# Altium schematic sheet Camera_MCU.SchDoc: Camera Board MCU
size A4; DrawnBy: byu17; Organization: ENEL429 Group 9; Address1: ECE Department; Address2: University of Canterbury; Address3: Christchurch 8041; Address4: New Zealand; Revision: 1
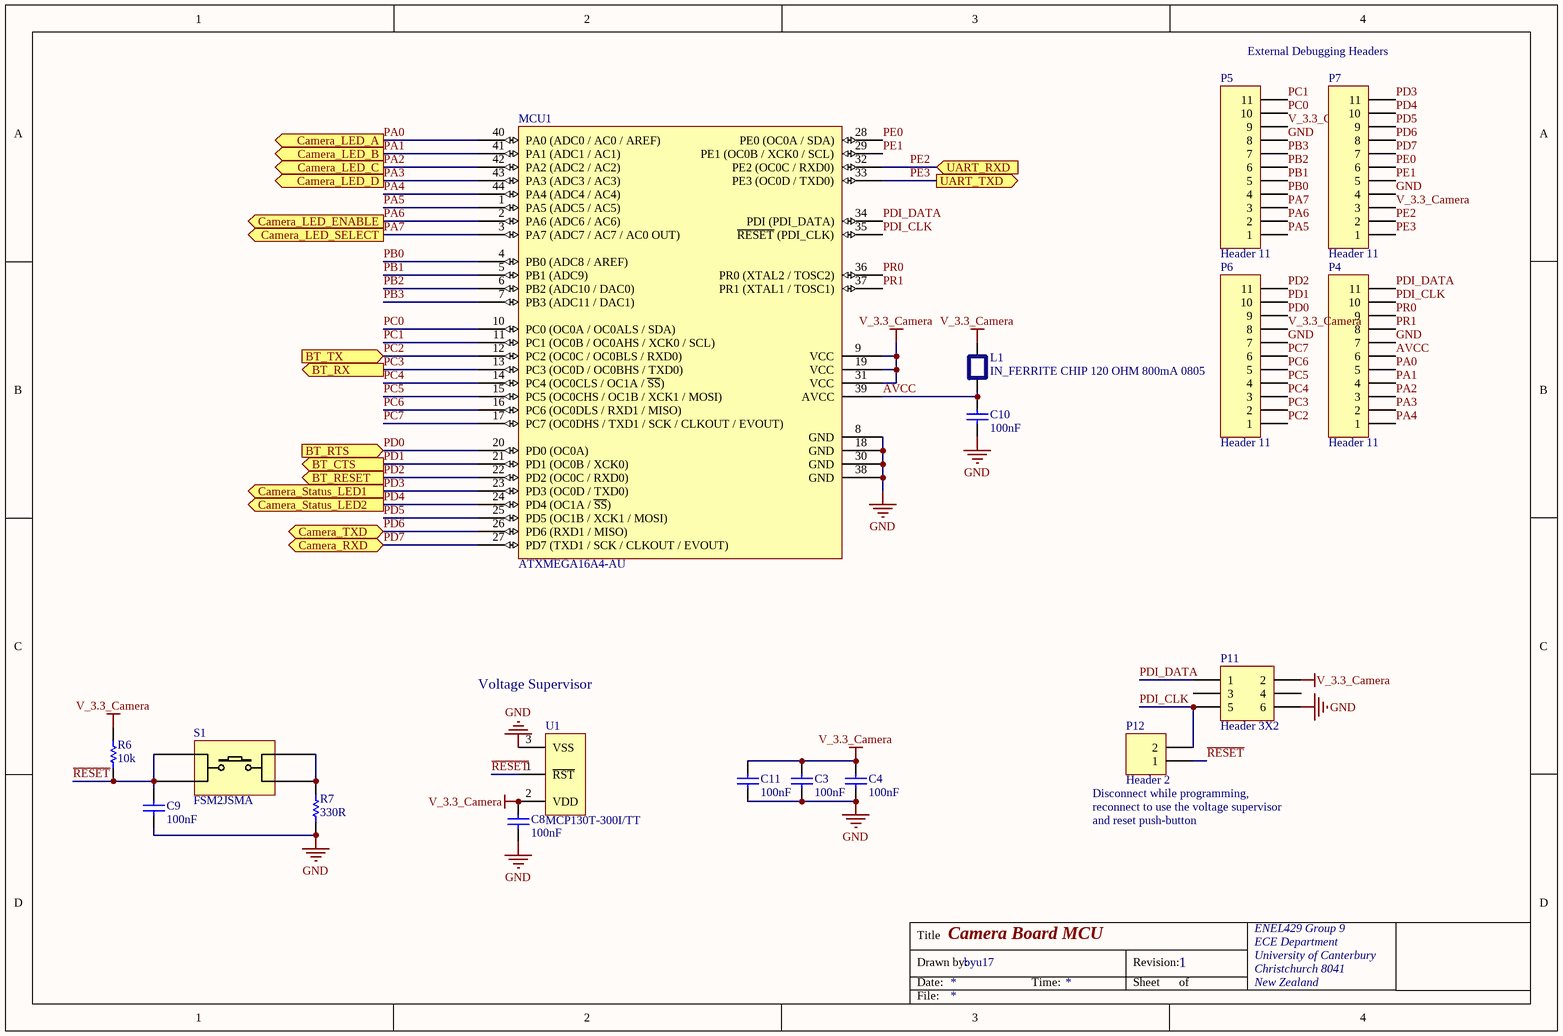
[diagram p0: Camera_MCU.SchDoc]

## Parts
C3  100nF  [0603]
C4  100nF  [0603]
C8  100nF  [0603]
C9  100nF  [0603]
C10  100nF  [0603]
C11  100nF  [0603]
L1  IN_FERRITE CHIP 120 OHM 800mA 0805  [0805]
MCU1  ATXMEGA16A4-AU  [TQFP80P1200X1200X120-44N]
P4  Header 11  [HDR1X11]
P5  Header 11  [HDR1X11]
P6  Header 11  [HDR1X11]
P7  Header 11  [HDR1X11]
P11  Header 3X2  [HDR2X3]
P12  Header 2  [HDR1X2]
R6  10k  [0603]
R7  330R  [0603]
S1  FSM2JSMA  [FSM2JSMA]
U1  MCP130T-300I/TT  [SOT-23-TT3_N]

## Ports
BT_CTS (out), BT_RESET (out), BT_RTS (in), BT_RX (out), BT_TX (in), Camera_LED_A (out), Camera_LED_B (out), Camera_LED_C (out), Camera_LED_D (out), Camera_LED_ENABLE (out), Camera_LED_SELECT (out), Camera_RXD, Camera_Status_LED1 (out), Camera_Status_LED2 (out), Camera_TXD, UART_RXD (in), UART_TXD (out)

## Nets
GND: C3.1 C4.1 C8.2 C9.2 C10.1 C11.2 MCU1.8(GND) MCU1.18(GND) MCU1.30(GND) MCU1.38(GND) P4.7 P5.8 P6.7 P7.4 P11.6 R7.1 U1.3(VSS)
V_3.3_Camera: C3.2 C4.2 C8.1 C11.1 L1.1 MCU1.9(VCC) MCU1.19(VCC) MCU1.31(VCC) P5.9 P6.8 P7.3 P11.2 R6.2 U1.2(VDD)
AVCC: C10.2 L1.2 MCU1.39(AVCC) P4.6
PA0: MCU1.40(PA0_(ADC0_/_AC0_/_AREF)) P4.5 ; port Camera_LED_A
PA1: MCU1.41(PA1_(ADC1_/_AC1)) P4.4 ; port Camera_LED_B
PA2: MCU1.42(PA2_(ADC2_/_AC2)) P4.3 ; port Camera_LED_C
PA3: MCU1.43(PA3_(ADC3_/_AC3)) P4.2 ; port Camera_LED_D
PA4: MCU1.44(PA4_(ADC4_/_AC4)) P4.1
PA5: MCU1.1(PA5_(ADC5_/_AC5)) P5.1
PA6: MCU1.2(PA6_(ADC6_/_AC6)) P5.2 ; port Camera_LED_ENABLE
PA7: MCU1.3(PA7_(ADC7_/_AC7_/_AC0_OUT)) P5.3 ; port Camera_LED_SELECT
PB0: MCU1.4(PB0_(ADC8_/_AREF)) P5.4
PB1: MCU1.5(PB1_(ADC9)) P5.5
PB2: MCU1.6(PB2_(ADC10_/_DAC0)) P5.6
PB3: MCU1.7(PB3_(ADC11_/_DAC1)) P5.7
PC0: MCU1.10(PC0_(OC0A_/_OC0ALS_/_SDA)) P5.10
PC1: MCU1.11(PC1_(OC0B_/_OC0AHS_/_XCK0_/_SCL)) P5.11
PC2: MCU1.12(PC2_(OC0C_/_OC0BLS_/_RXD0)) P6.1 ; port BT_TX
PC3: MCU1.13(PC3_(OC0D_/_OC0BHS_/_TXD0)) P6.2 ; port BT_RX
PC4: MCU1.14(PC4_(OC0CLS_/_OC1A_/_~{SS})) P6.3
PC5: MCU1.15(PC5_(OC0CHS_/_OC1B_/_XCK1_/_MOSI)) P6.4
PC6: MCU1.16(PC6_(OC0DLS_/_RXD1_/_MISO)) P6.5
PC7: MCU1.17(PC7_(OC0DHS_/_TXD1_/_SCK_/_CLKOUT_/_EVOUT)) P6.6
PD0: MCU1.20(PD0_(OC0A)) P6.9 ; port BT_RTS
PD1: MCU1.21(PD1_(OC0B_/_XCK0)) P6.10 ; port BT_CTS
PD2: MCU1.22(PD2_(OC0C_/_RXD0)) P6.11 ; port BT_RESET
PD3: MCU1.23(PD3_(OC0D_/_TXD0)) P7.11 ; port Camera_Status_LED1
PD4: MCU1.24(PD4_(OC1A_/_~{SS})) P7.10 ; port Camera_Status_LED2
PD5: MCU1.25(PD5_(OC1B_/_XCK1_/_MOSI)) P7.9
PD6: MCU1.26(PD6_(RXD1_/_MISO)) P7.8 ; port Camera_TXD
PD7: MCU1.27(PD7_(TXD1_/_SCK_/_CLKOUT_/_EVOUT)) P7.7 ; port Camera_RXD
PDI_CLK: MCU1.35(~{RESET}_(PDI_CLK)) P4.10 P11.5 P12.2
PDI_DATA: MCU1.34(PDI_(PDI_DATA)) P4.11 P11.1
PE0: MCU1.28(PE0_(OC0A_/_SDA)) P7.6
PE1: MCU1.29(PE1_(OC0B_/_XCK0_/_SCL)) P7.5
PE2: MCU1.32(PE2_(OC0C_/_RXD0)) P7.2 ; port UART_RXD
PE3: MCU1.33(PE3_(OC0D_/_TXD0)) P7.1 ; port UART_TXD
PR0: MCU1.36(PR0_(XTAL2_/_TOSC2)) P4.9
PR1: MCU1.37(PR1_(XTAL1_/_TOSC1)) P4.8
~{RESET}: C9.1 P12.1 R6.1 S1.1 S1.2 U1.1(~{RST})
NetR7_2: R7.2 S1.3 S1.4

Not connected (* = marked no-connect by the designer): P11 3 4

## Notes on the sheet
- External Debugging Headers
- Voltage Supervisor
- (near P12) Disconnect while programming,
- (near P12) reconnect to use the voltage supervisor
- and reset push-button
- Title
- Drawn by:
- Date:
- Time:
- Revision:
- Sheet
- of
- File:

## Library data of the parts
C3 C4 C8-C11 = CP_100nF 0603: CAP CER .10UF 50V X5R 0603; Manufacturer: Taiyo Yuden; Manufacturer PN: UMK107B7104KA-T; Value: 100nF; Part Number: CP_100nF 0603; Component Kind: Standard; Component Type: Standard; Designator: CP_100nF 0603; Pin Count: 2; LatestRevisionDate: 29 May 08; Supplier 1: Digi-Key; Supplier Part Number 1: 478-6206-1-ND; Signal Integrity: Cap; Simulation: CAP
L1 = IN_FERRITE CHIP 120 OHM 800mA 0805: FERRITE CHIP 120 OHM 800mA 0805; Manufacturer: TDK; Manufacturer PN: MMZ2012Y121B; Part Number: IN_FERRITE CHIP 120 OHM 800mA 0805; Component Kind: Standard; Component Type: Standard; Designator: IN_FERRITE CHIP 120 OHM 800mA 0805; Pin Count: 2; Supplier 1: Digi-Key; Supplier Part Number 1: 445-2196-2-ND
MCU1 = ATXMEGA16A4-AU: Manufacturer: ATMEL; Manufacturer PN: ATXMEGA16A4-AU; Supplier 1: Element 14; Supplier Part Number 1: 1748552
P4-P7 = Header 11: Header, 11-Pin; LatestRevisionDate: 17-Jul-2002; LatestRevisionNote: Re-released for DXP Platform.; Publisher: Altium Limited
P11 = Header 3X2: Header, 3-Pin, Dual row; LatestRevisionDate: 17-Jul-2002; LatestRevisionNote: Re-released for DXP Platform.; Publisher: Altium Limited
P12 = Header 2: Header, 2-Pin; LatestRevisionDate: 17-Jul-2002; LatestRevisionNote: Re-released for DXP Platform.; Publisher: Altium Limited
R6 = RS_10k 0603: RES 10.0K OHM 1/10W 1% 0603 SMD; Manufacturer: Yageo; Manufacturer PN: RC0603FR-0710KL; Value: 10k; Part Number: RS_10k 0603; Component Kind: Standard; Component Type: Standard; Designator: RS_10k 0603; Pin Count: 2; LatestRevisionDate: 29 May 08; Supplier 1: Digi-Key; Supplier Part Number 1: 311-10.0KHRTR-ND; Signal Integrity: Res; Simulation: RESISTOR
R7 = RS_330R 0603: RES 330 OHM 1/10W 1% 0603 SMD; Manufacturer: Yageo; Manufacturer PN: RC0603FR-07330RL; Value: 330R; Part Number: RS_330R 0603; Component Kind: Standard; Component Type: Standard; Designator: RS_330R 0603; Pin Count: 2; LatestRevisionDate: 25 June 2009; Supplier 1: Digi-Key; Supplier Part Number 1: 311-330HRTR-ND; Signal Integrity: Res; Simulation: RESISTOR
S1 = SW_FSM2JSMA: DPST SMD Switch; Manufacturer: Tyco Electronics; Supplier 1: Element 14; Supplier Part Number 1: 3801287; price: 0.516; Supplier 2: Digi-Key; Supplier Part Number 2: 450-1130-ND; value: FSM2JSMA; Part Number: SW_FSM2JSMA; Component Kind: Standard; Component Type: Standard; Designator: SW_FSM2JSMA; Pin Count: 4
U1 = MCP130T-300I/TT: Microcontroller Supervisory Circuit with Open Drain Output, 3-Pin SOT-23, Industrial Temperature, Tape and Reel; FirstPublished: 29-Jan-2009; DatasheetVersion: revD, 2001; PackageVersion: revBB, Aug-2009; PackageReference: SOT-23-TT3; Publisher: Altium Limited; PackageDescription: 3-Lead Plastic Small Outline Transistor (TT) [SOT-23]; Supplier 1: Digi-Key; Supplier Part Number 1: MCP130T-300I/TTTR-ND; Supplier 2: Digi-Key; Supplier Part Number 2: MCP130T-300I/TTCT-ND; Supplier 3: Digi-Key; Supplier Part Number 3: MCP130T-300I/TTDKR-ND; Supplier 4: Farnell; Supplier Part Number 4: 1332070; Supplier 5: Newark; Supplier Part Number 5: 19C7176; Code_IPC: SOT23-3; ComponentLink1Description: Datasheet; ComponentLink1URL: http://ww1.microchip.com/downloads/en/DeviceDoc/11184d.pdf; ComponentLink2Description: Packaging Specification; ComponentLink2URL: http://www.microchip.com/stellent/groups/techpub_sg/documents/packagingspec/en012702.pdf; ComponentLink3Description: Microchip.com Home; ComponentLink3URL: http://www.microchip.com/